# EAGLE design iPad Charge Single V2 (EAGLE 5.11)
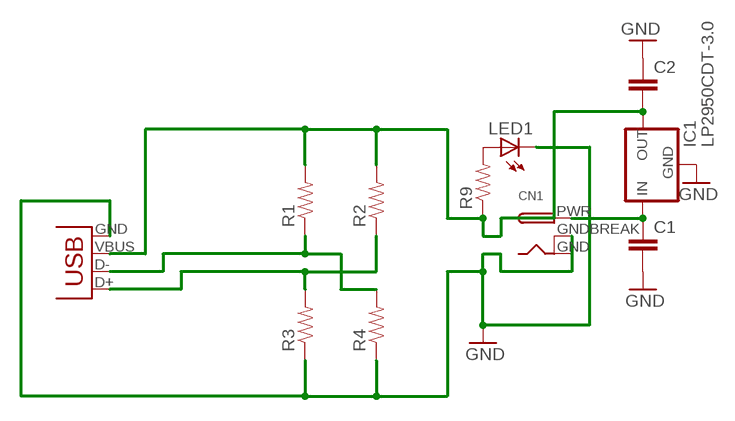
[diagram p0: schematic, sheet 1]

## Parts
C1  CAP0603-CAP  [0603-CAP]
C2  CAP0603-CAP  [0603-CAP]
CN1  DCBARRELPTH  [DCJACK_2MM_PTH]
IC1  LP2950CDT-3.0  [DPACK]
LED1  LED0603  [LED-0603]
R1  RESISTOR0603-RES  [0603-RES]
R2  RESISTOR0603-RES  [0603-RES]
R3  RESISTOR0603-RES  [0603-RES]
R4  RESISTOR0603-RES  [0603-RES]
R9  RESISTOR0603-RES  [0603-RES]
X1  USB-A-S  [USB-A-S]

## Nets
GND: C1.2 C2.1 CN1.GND CN1.GNDBREAK IC1.4(GND) LED1.C R3.1 R4.1 X1.GND
N$1: C2.2 IC1.3(OUT) R1.2 R2.2 R9.1 X1.VBUS
N$2: C1.1 CN1.PWR IC1.1(IN)
N$3: R2.1 R3.2 X1.D+
N$4: R1.1 R4.2 X1.D-
N$9: LED1.A R9.2

## Library data of the parts
C1 C2 = SparkFun:CAP: Capacitor Standard 0603 ceramic capacitor, and 0.1" leaded capacitor.
CN1 = adafruit:DCBARREL: 2.0mm DC Barrel Jack DCJACK_2MM_PTH - Through Hole Jack (4UConnector: 05537)
IC1 = v-reg:LP2950?*: Source: http://cache.national.com/ds/LP/LP2950.pdf
LED1 = SparkFun:LED: LEDs Standard schematic elements and footprints for 5mm, 3mm, 1206, and 0603 sized LEDs. 5mm - Spark Fun Electronics SKU : COM-00529 (and others)
R1-R4 R9 = SparkFun:RESISTOR: Resistor Basic schematic elements and footprints for 0603, 1206, and PTH resistors.
X1 = SparkFun:USB: USB Connectors USB-B-PTH is fully proven SKU : PRT-00139 USB-miniB is fully proven SKU : PRT-00587 USB-A-PCB is untested. USB-A-H is throughly reviewed, but untested. Spark Fun Electronics SKU : PRT-00437 USB-B-SMT is throughly reviewed, but untested. Needs silkscreen touching up. USB-A-S has not been used/tested USB-MB-H has not been used/tested

## Board
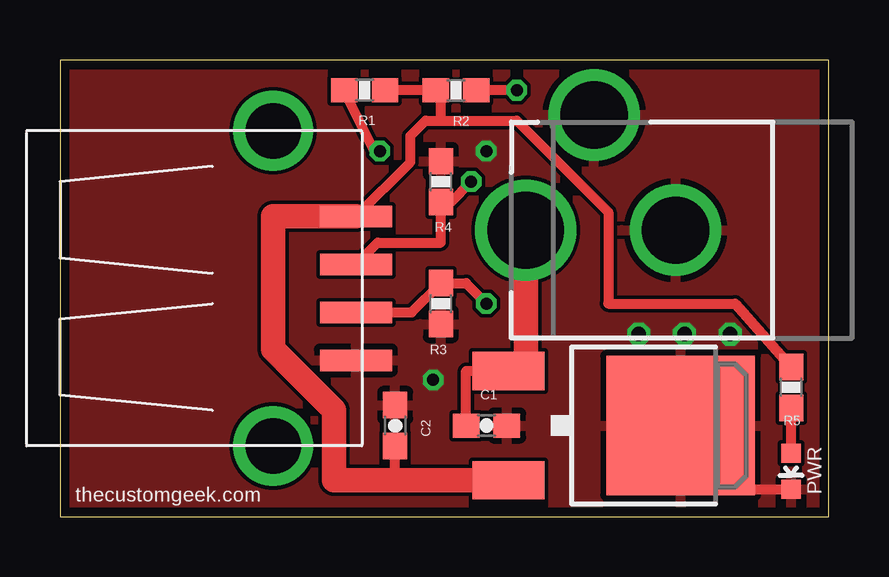
[diagram p1: board, top side]
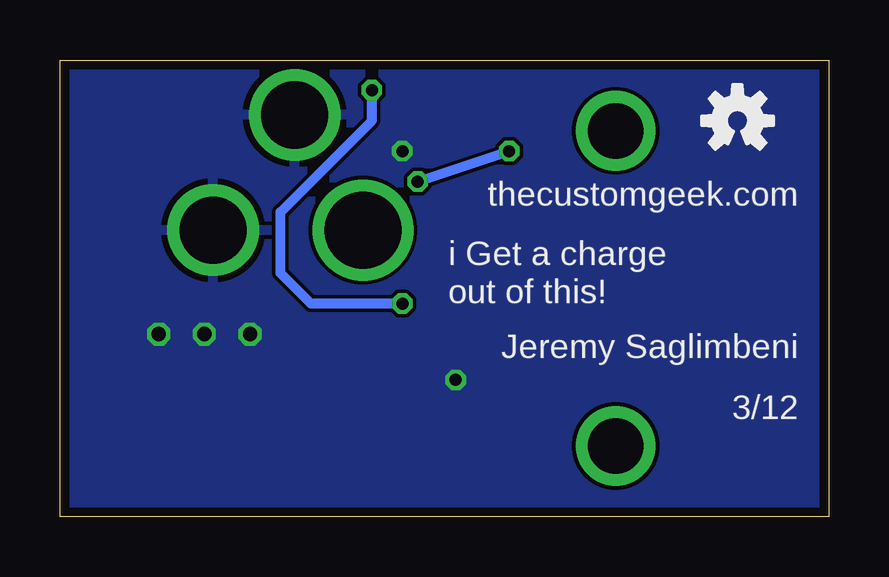
[diagram p2: board, bottom side, seen from below]

Size 32.05 x 19.04 mm. Coordinates in mm from the lower left corner, seen from the top.
Outline: 0,0 32.05,0 32.05,19.04 0,19.04 0,0
Copper layers (1*16): Top 0.0356mm / dielectric 1.5011mm / Bottom 0.0356mm
Design rules "LaenPCBOrder": minimum track width 6mil, minimum drill 13mil, track to track 6mil, track to pad 6mil, pad to pad 6mil, via to via 6mil, smd to smd 6mil, copper to edge 15mil, drill to drill 6mil, minimum pad ring 7mil, minimum via ring 7mil, stop-mask expansion 4mil, vias tented up to drill 0mil, thermal gap 10mil

### Footprints (pad centres in the part's own frame; a part is rotated, then mirrored left to right if it is on the bottom)
0603-CAP = smd 1.1 x 1: 1 -0.85,0; 2 0.85,0
DCJACK_2MM_PTH = drill 2.8 round: GND 0,7.35; GNDBREAK 4.8,10.75 | drill 3.2 round: PWR 0,13.6
DPACK = smd 1.6 x 3: 1 -2.28,-4.8; 3 2.28,-4.8 | smd 5.8 x 6.2: 4 0,2.38
LED-0603 = smd 0.8 x 0.8: A 0,-0.75; C 0,0.75
0603-RES = smd 1.1 x 1: 1 -0.85,0; 2 0.85,0
USB-A-S = smd 3 x 0.9: D+ 3.45,-1; D- 3.45,1; GND 3.45,-3; VBUS 3.45,3 | drill 2.311 round: P$5 0,-6.566; P$6 0,6.566

### Placement (x,y rotation side)
C1  17.78,3.81 0 top
C2  13.97,3.81 270 top
CN1  33.02,11.95 90 top
IC1  23.5,3.81 270 top
LED1  30.48,1.91 180 top
R1  12.7,17.78 0 top
R2  16.51,17.78 180 top
R3  15.88,8.89 90 top
R4  15.88,13.97 270 top
R9  30.48,5.4 270 top
U$2  [OSHW-LOGO-S]  3.81,16.51 0 bottom
X1  8.89,9.53 0 top

### Tracks (layer width: path | path; a pad name or v marks a point on that pad's centre or on a via)
GND  (via drill 0.5, 0.6)
  Top 0.406: LED1.C 25.88,1.16 IC1.4
  other vias: 24.13,7.62 26.04,7.62 27.94,7.62 15.56,5.71 17.78,15.24
  pour Top: 0,19.05 32.38,19.05 32.38,0 0,0
  pour Bottom: 0,19.05 32.38,19.05 32.38,0 0,0
N$1
  Top 0.406: R1.2 R2.2 15.88,17.57 15.88,16.51 | R9.1 28.16,8.89 22.86,8.89 22.86,12.7 19.05,16.51 15.88,16.51 | 13.97,1.53 C2.2 | X1.VBUS 14.61,14.79 14.61,15.88 15.24,16.51 15.88,16.51
  Top 1.016: IC1.3 13.97,1.53 11.43,1.53 11.43,4.45 8.89,6.99 8.89,12.53 X1.VBUS
N$2
  Top 0.406: C1.1 16.93,6.09 IC1.1 19.42,6.09
  Top 1.016: 19.42,6.09 CN1.PWR
N$3  (via drill 0.5)
  Top 0.406: X1.D+ 14.66,8.53 R3.2 16.93,9.74 v17.78,8.89 | v19.05,17.78 R2.1
  Bottom 0.406: v17.78,8.89 21.59,8.89 22.86,10.16 22.86,12.7 19.05,16.51 v19.05,17.78
N$4  (via drill 0.5)
  Top 0.406: X1.D- 13.24,11.43 15.88,11.43 R4.2 16.3,13.12 v17.14,13.97 | v13.34,15.24 13.12,15.24 R1.1
  Bottom 0.406: v17.14,13.97 v13.34,15.24
N$9
  Top 0.406: LED1.A R9.2

### Text on the board
tPlace: R5 | thecustomgeek.com | PWR
bPlace: thecustomgeek.com | i Get a charge | out of this! | Jeremy Saglimbeni | 3/12